# Altium schematic sheet General.SchDoc
size 276 x 198 mm; SheetNumber: 1; SheetTotal: 3
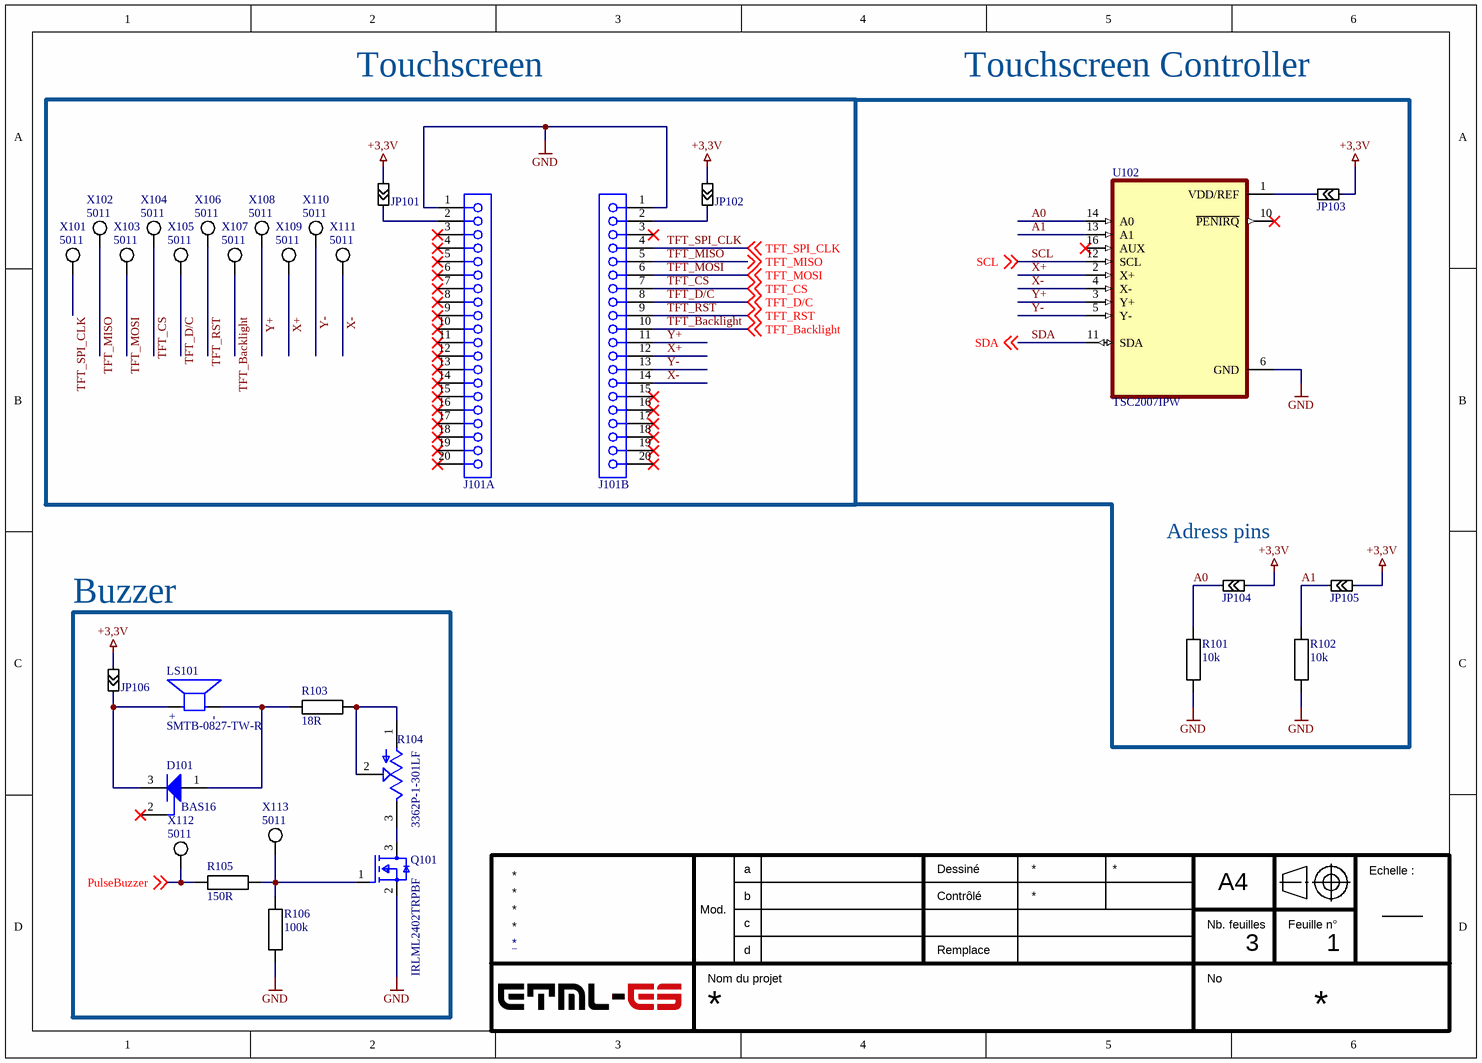
[diagram p0: General.SchDoc]

## Parts
D101  BAS16  [INF-SOT23_L]
J101A  61302011821  [61302011821]  (value not drawn)
J101B  61302011821  [61302011821]  (value not drawn)
JP101  Jumper Pad  [Jumper SMD]  (value not drawn)
JP102  Jumper Pad  [Jumper SMD]  (value not drawn)
JP103  Jumper Pad  [Jumper SMD]  (value not drawn)
JP104  Jumper Pad  [Jumper SMD]  (value not drawn)
JP105  Jumper Pad  [Jumper SMD]  (value not drawn)
JP106  Jumper Pad  [Jumper SMD]  (value not drawn)
LS101  SMTB-0827-TW-R  [XDCR_SMTB-0827-TW-R]
Q101  IRLML2402TRPBF  [SOT95P237X112-3N]
R101  10k  [RESC2012X06M]
R102  10k  [RESC2012X06M]
R103  18R  [RESC2012X06M]
R104  3362P-1-301LF  [TRIM_3362P-1-301LF]
R105  150R  [RESC2012X06M]
R106  100k  [RESC2012X06M]
U102  TSC2007IPW  [SOP65P640X120-16N]
X101  5011  [Keystone_5011]
X102  5011  [Keystone_5011]
X103  5011  [Keystone_5011]
X104  5011  [Keystone_5011]
X105  5011  [Keystone_5011]
X106  5011  [Keystone_5011]
X107  5011  [Keystone_5011]
X108  5011  [Keystone_5011]
X109  5011  [Keystone_5011]
X110  5011  [Keystone_5011]
X111  5011  [Keystone_5011]
X112  5011  [Keystone_5011]
X113  5011  [Keystone_5011]

## Blocks framed on the sheet
Touchscreen: J101A J101B JP101 JP102 X101-X111
Buzzer: D101 JP106 LS101 Q101 R103-R106 X112 X113

## Nets
+3,3V: JP101.2 JP102.2 JP103.2 JP104.2 JP105.2 JP106.2
GND: J101A.1 J101B.1 Q101.2(S) R101.1 R102.1 R106.1 U102.6(GND)
A0: JP104.1 R101.2 U102.14(A0)
A1: JP105.1 R102.2 U102.13(A1)
PulseBuzzer: R105.1 X112.1(TP) ; off-sheet PulseBuzzer
SCL: U102.12(SCL) ; off-sheet SCL
SDA: U102.11(SDA) ; off-sheet SDA
TFT_Backlight: J101B.10 X107.1(TP) ; off-sheet TFT_Backlight
TFT_CS: J101B.7 X104.1(TP) ; off-sheet TFT_CS
TFT_D/C: J101B.8 X105.1(TP) ; off-sheet TFT_D/C
TFT_MISO: J101B.5 X102.1(TP) ; off-sheet TFT_MISO
TFT_MOSI: J101B.6 X103.1(TP) ; off-sheet TFT_MOSI
TFT_RST: J101B.9 X106.1(TP) ; off-sheet TFT_RST
TFT_SPI_CLK: J101B.4 X101.1(TP) ; off-sheet TFT_SPI_CLK
X+: J101B.12 U102.2(X+) X109.1(TP)
X-: J101B.14 U102.4(X-) X111.1(TP)
Y+: J101B.11 U102.3(Y+) X108.1(TP)
Y-: J101B.13 U102.5(Y-) X110.1(TP)
NetD101_1: D101.1(A) LS101.N(NEG) R103.2
NetD101_3: D101.3(K) JP106.1 LS101.P(POS)
NetJ101A_2: J101A.2 JP101.1
NetJ101B_2: J101B.2 JP102.1
NetJP103_1: JP103.1 U102.1(VDD/REF)
NetQ101_1: Q101.1(G) R105.2 R106.2 X113.1(TP)
NetQ101_3: Q101.3(D) R104.3(CW)
NetR103_1: R103.1 R104.1(CCW) R104.2(WIPER)

Not connected (* = marked no-connect by the designer): D101 2(NC)*; J101A 3* 4* 5* 6* 7* 8* 9* 10* 11* 12* 13* 14* 15* 16* 17* 18* 19* 20*; J101B 3* 15* 16* 17* 18* 19* 20*; U102 10(~{PENIRQ})* 16(AUX)*

## Notes on the sheet
- Touchscreen Controller
- Adress pins
- a
- Dessiné
- A4
- Echelle :
- Mod.
- b
- c
- d
- Contrôlé
- Remplace
- Nb. feuilles
- Feuille n°
- Nom du projet
- No
- (in symbol SMTB-0827-TW-R) +; -

## Library data of the parts
D101 = CMP-1176-00017-1: Silicon Switching Diode, SOT23, Reel, Green; Manufacturer: Infineon; VR (max): 80Â V; VBR (min): 85Â V; Configuration: Single; Green: TRUE; VF (max): 1.25Â V; trr (max): 4Â ns; IF (max): 250Â mA; IR (max): 100Â nA; ComponentLink3Description: Package Specification; PackageVersion: Apr-08; PackageReference: SOT23; ComponentLink2URL: http://www.infineon.com/dgdl/bas16series.pdf?folderId=db3a30431400ef6801141b5844e103ea&fileId=db3a30431400ef6801141b93811b03ff; Mounting Technology: Surface Mount; PartNumber: BAS16; ComponentLink2Description: Datasheet; ComponentLink1Description: Manufacturer URL; ComponentLink1URL: http://www.infineon.com/; ComponentLink3URL: http://www.infineon.com/dgdl/SOT23-Package_Overview.pdf?folderId=db3a30431936bc4b0119532290053c66&fileId=db3a30431936bc4b0119533468123c85; PackageDescription: 3-Pin Small Outline Transistor Package, 1.3 x 2.9 mm Body, 0.95 mm Pitch
J101A J101B = 61302011821: WR-PHD Socket Header, THT, Vertical, pitch 2.54mm, 1 Row, 20P; Manufacturer: Wurth Elektronik; Contact Resistance: 20mOhm; Rated Current: 3A; Working Voltage: 250V; Withstanding Voltage: 500V; Manufacturer Part Number: 61302011821; Category: Board-to-Board Connectors; Match Code: WR-PHD; ComponentLink1Description: Website Link; ComponentLink1URL: https://www.we-online.com/redexpert/article/61302011821?ad; ComponentLink2Description: Datasheet Link; ComponentLink2URL: https://www.we-online.com/redexpert/spec/61302011821?ad; Mount: Through Hole; Operating Temperature Max: 105°C; Operating Temperature Min: -40°C; Packaging: Tray; Gender: Socket Header; Number of Pins: 20; Number of Rows: 1; Orientation: Vertical; Pitch: 2.54mm
JP101-JP106 = Jumper Pad: SMD Jumper
LS101 = SMTB-0827-TW-R: SURFACE MOUNT TRANSDUCER 3.6 V0-P; MF: PUI Audio, Inc.; Purchase-URL: https://pricing.snapeda.com/search/part/SMTB-0827-TW-R/?ref=eda; Package: None; Digi-Key_Part_Number: 668-SMTB-0827-TW-RTR-ND; MP: SMTB-0827-TW-R; Check_prices: https://www.snapeda.com/parts/SMTB-0827-TW-R/PUI+Audio%252C+Inc./view-part/?ref=eda; SnapEDA_Link: https://www.snapeda.com/parts/SMTB-0827-TW-R/PUI+Audio%252C+Inc./view-part/?ref=snap; Value: *
Q101 = IRLML2402TRPBF: MOSFET N-CH 20V 1.2A SOT-23; Max Power Dissipation: 540mW; Gate to Source Voltage (Vgs): 12V; Drain to Source Resistance: 350mR; Rise Time: 9.5ns; Threshold Voltage: 700mV; Turn-On Delay Time: 2.5ns; Input Capacitance: 110pF; Element Configuration: Single; Power Dissipation: 540W; Turn-Off Delay Time: 9.7ns; Rds On Max: 250mR; REACH SVHC: No SVHC; Mount: Surface Mount; Packaging: Tape and Reel; Height: 0.04inch; Drain to Source Voltage (Vdss): 20V; Length: 0.119inch; Contact Plating: Tin; Continuous Drain Current (ID): 1.2A; Lead Free: Lead Free; Drain to Source Breakdown Voltage: 20V; Max Dual Supply Voltage: 20V; Number of Pins: 3; Halogen Free: Halogen Free; Max Operating Temperature: 150°C; Case/Package: SOT-23; Min Operating Temperature: -55°C; Width: 0.055inch
R101 R102 = CMP-066-000199-2: RES 10kohm  ±1% 0.125W 2012 (0805 INCH); Manufacturer Number: RC0805FR-0710KL; Manufacturer: Yageo; PN: PN-374909; TemperatureCoeff: ±200ppm/°C; Voltage: 150V; TemperatureRange: -55°C to 155°C; IsStocked: 1; Tolerance: ±1%; Category: Passives; Value: 10k; Supplier Price 1: 0.0200; Supplier Part Number 1: FAB.0805_R 10k; Supplier 1: ETML; SubCategory: Resistances couche epaisse; Power: 0.125W
R103 = CMP-066-000166-2: RES 18ohm  ±1% 0.125W 2012 (0805 INCH); Manufacturer: Yageo; Manufacturer Number: RC0805FR-0718RL; TemperatureRange: -55°C to 155°C; TemperatureCoeff: ±200ppm/°C; Voltage: 150V; Value: 18; PN: PN-496535; IsStocked: 1; Category: Passives; Power: 0.125W; Supplier Price 1: 0.0200; Tolerance: ±1%; Supplier 1: ETML; Supplier Part Number 1: FAB.0805_R 18R; SubCategory: Resistances couche epaisse
R104 = 3362P-1-301LF: 300 Ohms 0.5W, 1/2W PC Pins Through Hole Trimmer Potentiometer Cermet 1 Turn Top Adjustment; MF: Bourns; Package: 3362P-1 Bourns Inc.; Price: None; Availability: Bad; Check_prices: https://www.snapeda.com/parts/3362P-1-301LF/Bourns/view-part/620352/?ref=eda; MP: 3362P-1-301LF; SnapEDA_Link: https://www.snapeda.com/parts/3362P-1-301LF/Bourns/view-part/620352/?ref=snap; Value: *
R105 = CMP-066-000177-2: RES 150ohm  ±1% 0.125W 2012 (0805 INCH); Manufacturer: Yageo; Manufacturer Number: RC0805FR-07150RL; Value: 150; TemperatureRange: -55°C to 155°C; Voltage: 150V; TemperatureCoeff: ±200ppm/°C; PN: PN-455993; IsStocked: 1; Supplier Price 1: 0.0200; Tolerance: ±1%; SubCategory: Resistances couche epaisse; Power: 0.125W; Supplier Part Number 1: FAB.0805_R 150R; Supplier 1: ETML; Category: Passives
R106 = CMP-066-000211-2: RES 100kohm  ±1% 0.125W 2012 (0805 INCH); Manufacturer: Yageo; Manufacturer Number: RC0805FR-07100KL; TemperatureCoeff: ±200ppm/°C; Voltage: 150V; TemperatureRange: -55°C to 155°C; IsStocked: 1; PN: PN-903408; Category: Passives; Supplier Part Number 1: FAB.0805_R 100k; Value: 100k; Tolerance: ±1%; Supplier Price 1: 0.0200; Power: 0.125W; SubCategory: Resistances couche epaisse; Supplier 1: ETML
U102 = TSC2007IPW: 12-Bit, nanopower, 4-wire micro touch screen controller &nbsp; 16-TSSOP -40 to 85; MF: Texas Instruments; Digi-Key_Part_Number: 296-42398-2-ND; Purchase-URL: https://pricing.snapeda.com/search/part/TSC2007IPW/?ref=eda; Package: TSSOP-16 Texas Instruments; MP: TSC2007IPW; Value: *; SnapEDA_Link: https://www.snapeda.com/parts/TSC2007IPW/Texas%20Instruments/view-part/291616/?ref=snap; Check_prices: https://www.snapeda.com/parts/TSC2007IPW/Texas%20Instruments/view-part/291616/?ref=eda
X101-X113 = CMP-054-000005-1: TEST THT MULTIPURPOSE BK; Manufacturer: Keystone; IsStocked: True; PN: PN-926990; Supplier 1: ETML; Value: 5011; Manufacturer Number: 5011; Supplier Part Number 1: MAG.428.014; Category: Connectors; SubCategory: Testpoints; Supplier Price 1: 0.2439